# Altium schematic sheet Rectfier.SchDoc
size A4
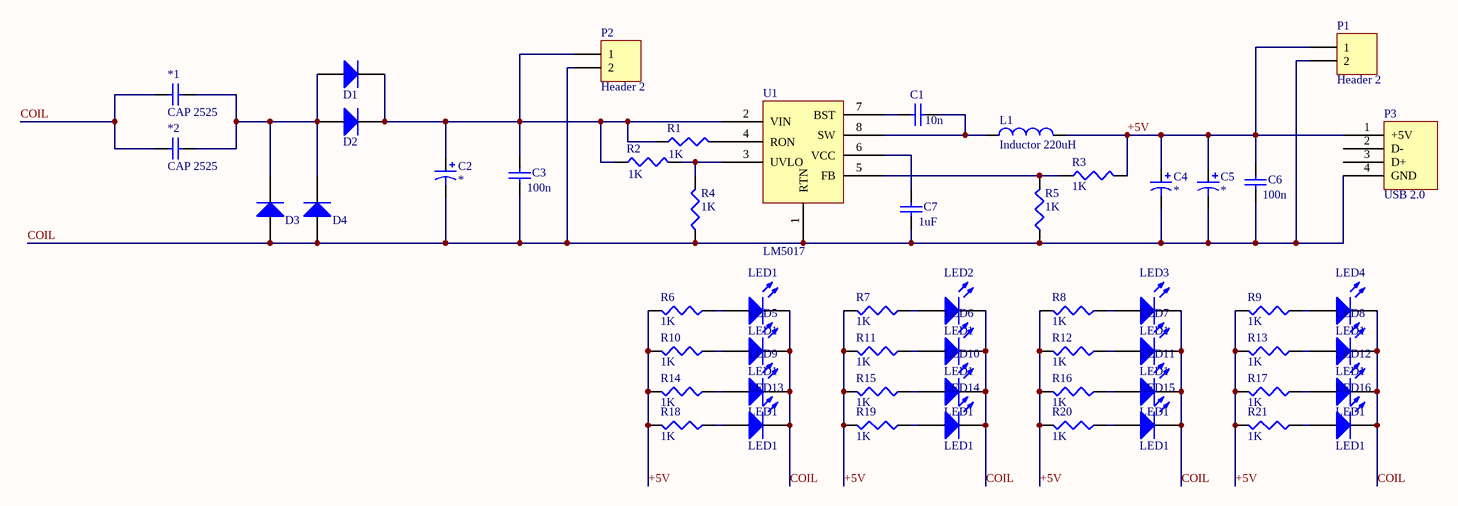
[diagram p0: Rectfier.SchDoc]

## Parts
*1  CAP 2525  [CAP 2525]
*2  CAP 2525  [CAP 2525]
C1  value 10n  [0603 IPC Low Density]  (hidden comment: Cap Semi)
C2  CAP SMD ELECT  [CAP 200uF]  (value not drawn)
C3  value 100n  [0805 IPC Low Density]  (hidden comment: Cap Semi)
C4  CAP SMD ELECT  [CAP 47uF]  (value not drawn)
C5  CAP SMD ELECT  [CAP 47uF]  (value not drawn)
C6  value 100n  [1206 IPC Low Density]  (hidden comment: Cap Semi)
C7  value 1uF  [0603 IPC Low Density]  (hidden comment: Cap Semi)
D1  SiC Schottky Diode  [TO-263-2]  (value not drawn)
D2  SiC Schottky Diode  [QFN 3.3]  (value not drawn)
D3  SiC Schottky Diode  [QFN 3.3]  (value not drawn)
D4  SiC Schottky Diode  [TO-263-2]  (value not drawn)
L1  Inductor 220uH  [220u Indcutor small]
LED1  LED1  [LED 5MM]
LED2  LED1  [LED 5MM]
LED3  LED1  [LED 5MM]
LED4  LED1  [LED 5MM]
LED5  LED1  [LED 5MM]
LED6  LED1  [LED 5MM]
LED7  LED1  [LED 5MM]
LED8  LED1  [LED 5MM]
LED9  LED1  [LED 5MM]
LED10  LED1  [LED 5MM]
LED11  LED1  [LED 5MM]
LED12  LED1  [LED 5MM]
LED13  LED1  [LED 5MM]
LED14  LED1  [LED 5MM]
LED15  LED1  [LED 5MM]
LED16  LED1  [LED 5MM]
P1  Header 2  [HDR1X2]
P2  Header 2  [HDR1X2]
P3  USB 2.0  [USB 2.0]
R1  value 1K  [RESISTOR 0603]  (hidden comment: Res3)
R2  value 1K  [RESISTOR 0603]  (hidden comment: Res3)
R3  value 1K  [RESISTOR 0603]  (hidden comment: Res3)
R4  value 1K  [RESISTOR 0603]  (hidden comment: Res3)
R5  value 1K  [RESISTOR 0603]  (hidden comment: Res3)
R6  value 1K  [RESISTOR 0603]  (hidden comment: Res3)
R7  value 1K  [RESISTOR 0603]  (hidden comment: Res3)
R8  value 1K  [RESISTOR 0603]  (hidden comment: Res3)
R9  value 1K  [RESISTOR 0603]  (hidden comment: Res3)
R10  value 1K  [RESISTOR 0603]  (hidden comment: Res3)
R11  value 1K  [RESISTOR 0603]  (hidden comment: Res3)
R12  value 1K  [RESISTOR 0603]  (hidden comment: Res3)
R13  value 1K  [RESISTOR 0603]  (hidden comment: Res3)
R14  value 1K  [RESISTOR 0603]  (hidden comment: Res3)
R15  value 1K  [RESISTOR 0603]  (hidden comment: Res3)
R16  value 1K  [RESISTOR 0603]  (hidden comment: Res3)
R17  value 1K  [RESISTOR 0603]  (hidden comment: Res3)
R18  value 1K  [RESISTOR 0603]  (hidden comment: Res3)
R19  value 1K  [RESISTOR 0603]  (hidden comment: Res3)
R20  value 1K  [RESISTOR 0603]  (hidden comment: Res3)
R21  value 1K  [RESISTOR 0603]  (hidden comment: Res3)
U1  LM5017  [SOIC8_THERMAL]

## Nets
+5V: C4.A C5.A C6.2 L1.2 P1.1 P3.1(+5V) R3.2 R6.2 R7.2 R8.2 R9.2 R10.2 R11.2 R12.2 R13.2 R14.2 R15.2 R16.2 R17.2 R18.2 R19.2 R20.2 R21.2
COIL: *1.1 *2.1 C2.C C3.1 C4.C C5.C C6.1 C7.1 D3.A D4.A LED1.K LED2.K LED3.K LED4.K LED5.K LED6.K LED7.K LED8.K LED9.K LED10.K LED11.K LED12.K LED13.K LED14.K LED15.K LED16.K P1.2 P2.2 P3.4(GND) R4.1 R5.1 U1.1(RTN)
Net*1_2: *1.2 *2.2 D1.A D2.A D3.C D4.C
NetC1_1: C1.1 U1.7(BST)
NetC1_2: C1.2 L1.1 U1.8(SW)
NetC2_A: C2.A C3.2 D1.C D2.C P2.1 R1.1 R2.1 U1.2(VIN)
NetC7_2: C7.2 U1.6(VCC)
NetLED1_A: LED1.A R6.1
NetLED2_A: LED2.A R7.1
NetLED3_A: LED3.A R8.1
NetLED4_A: LED4.A R9.1
NetLED5_A: LED5.A R10.1
NetLED6_A: LED6.A R11.1
NetLED7_A: LED7.A R12.1
NetLED8_A: LED8.A R13.1
NetLED9_A: LED9.A R14.1
NetLED10_A: LED10.A R15.1
NetLED11_A: LED11.A R16.1
NetLED12_A: LED12.A R17.1
NetLED13_A: LED13.A R18.1
NetLED14_A: LED14.A R19.1
NetLED15_A: LED15.A R20.1
NetLED16_A: LED16.A R21.1
NetR1_2: R1.2 U1.4(RON)
NetR2_2: R2.2 R4.2 U1.3(UVLO)
NetR3_1: R3.1 R5.2 U1.5(FB)

Not connected (* = marked no-connect by the designer): P3 2(D-) 3(D+)

## Library data of the parts
C1 C3 C6 C7 = Cap Semi: Capacitor (Semiconductor SIM Model); Published: 8-Jun-2000; LatestRevisionDate: 29-May-2009; LatestRevisionNote: IPC-7351 Footprint Added.; PackageReference: C1206; Publisher: Altium Limited; PackageDescription: Chip Capacitor
D1-D4 = SiC Schottky Diode: Cree Silicon Carbide Schottky Diode
P1 P2 = Header 2: Header, 2-Pin; LatestRevisionDate: 17-Jul-2002; LatestRevisionNote: Re-released for DXP Platform.; Publisher: Altium Limited
R1-R21 = Res3: Resistor; Published: 8-Jun-2000; LatestRevisionDate: 29-May-2009; LatestRevisionNote: IPC-7351 Footprint Added.; PackageReference: J1-0603; Publisher: Altium Limited; PackageDescription: Chip Resistor
C2 C4 C5 = CAP SMD ELECT: Value: *